# Altium schematic sheet MANEA_TCAD_PROIECT_Sheet1.SchDoc (part 3 of 3)
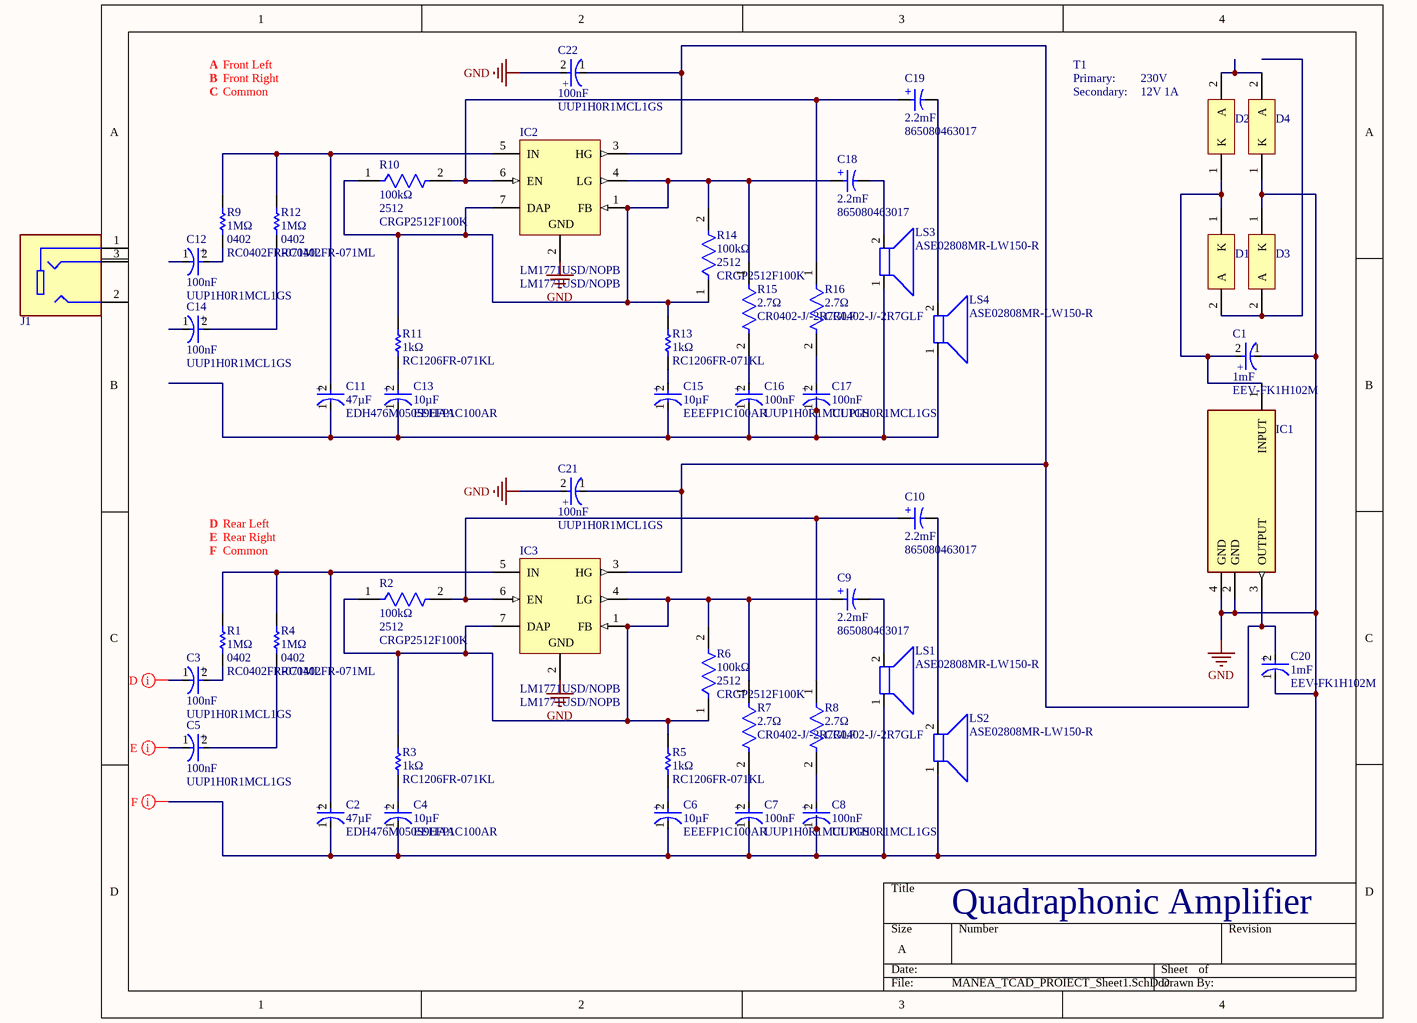
[diagram p2: MANEA_TCAD_PROIECT_Sheet1.SchDoc]

## Library data of the parts (continued)
R3 R5 R11 R13 = RC1206FR-071KL: 250mW Thick Film Resistors 200V ±100ppm/℃ ±1% 1kΩ 1206 Chip Resistor - Surface Mount ROHS; Manufacturer: Yageo Group; Temperature Coefficient: 100ppm/°C; Supplier: Farnell; Supplier Part Number: RC1206FR-071KL; Manufacturer Part Number: RC1206FR-071KL; RoHS: Compliant; Category: Chip SMD Resistors; Stock: 132012; Pricing: 500=500, 1000=0.05, 2500=0.05 (EUR); Case/Package: 1206; Case Code (Imperial): 1206; Case Code (Metric): 3216; China RoHS: Non-Compliant; Composition: Thick Film; Country of Origin: Mainland China, Taiwan; Depth: 1.6mm; Export Control Classification Number (ECCN) Code: EAR99; Height: 550µm; Harmonized Tariff Schedule (HTS) Code: 8533.21.00.30; Introduction Date: 2008-07-18; Lead Free: Lead Free; Length: 3.1mm; Lifecycle Status: Production; Max Operating Temperature: 155°C; Military Standard: Not; Min Operating Temperature: -55°C; Mounting Technology: Surface Mount; Pins: 2; Number of Terminals: 2; Packaging: Tape & Reel; Power Dissipation: 250mW; Power Rating: 250mW; REACH SVHC: Yes; Schedule B: 8533210045, 8533210045|8533210045, 8533210045|8533210045|8533210045, 8533210045|8533210045|8533210045|8533210045; Termination: SMD/SMT; Tolerance: 1%; Voltage Rating: 200V; Voltage Rating (AC): 200V; Voltage Rating (DC): 200V; Width: 1.6mm; Working Voltage: 200V; ComponentLink1URL: https://datasheet.octopart.com:443/RC1206FR-071KL-Yageo-datasheet-175887523.pdf?src-supplier=Newark; ComponentLink1Description: https://datasheet.octopart.com:443/RC1206FR-071KL-Yageo-datasheet-175887523.pdf?src-supplier=Newark; ComponentLink2URL: https://datasheet.octopart.com:443/RC1206FR-071KL-Yageo-datasheet-103092701.pdf?src-supplier=Upverter; ComponentLink2Description: https://datasheet.octopart.com:443/RC1206FR-071KL-Yageo-datasheet-103092701.pdf?src-supplier=Upverter; ComponentLink3URL: https://datasheet.octopart.com:443/RC1206FR-071KL-Yageo-datasheet-98239111.pdf?src-supplier=Upverter; ComponentLink3Description: https://datasheet.octopart.com:443/RC1206FR-071KL-Yageo-datasheet-98239111.pdf?src-supplier=Upverter; ComponentLink4URL: https://datasheet.octopart.com:443/RC1206FR-071KL-Yageo-datasheet-8359522.pdf?src-supplier=element14+APAC; ComponentLink4Description: https://datasheet.octopart.com:443/RC1206FR-071KL-Yageo-datasheet-8359522.pdf?src-supplier=element14+APAC; ComponentLink5URL: https://datasheet.octopart.com:443/RC1206FR-071KL-Yageo-datasheet-13032847.pdf?src-supplier=element14+APAC; ComponentLink5Description: https://datasheet.octopart.com:443/RC1206FR-071KL-Yageo-datasheet-13032847.pdf?src-supplier=element14+APAC; ComponentLink6URL: https://datasheet.octopart.com:443/RC1206FR-071KL-Yageo-datasheet-62067350.pdf?src-supplier=Farnell; ComponentLink6Description: https://datasheet.octopart.com:443/RC1206FR-071KL-Yageo-datasheet-62067350.pdf?src-supplier=Farnell; ComponentLink7URL: https://datasheet.octopart.com:443/RC1206FR-071KL-Yageo-Group-datasheet-176638170.pdf?src-supplier=Future+Electronics; ComponentLink7Description: https://datasheet.octopart.com:443/RC1206FR-071KL-Yageo-Group-datasheet-176638170.pdf?src-supplier=Future+Electronics; ComponentLink8URL: https://datasheet.octopart.com:443/RC1206FR-071KL-Yageo-datasheet-164759695.pdf?src-supplier=Future+Electronics; ComponentLink8Description: https://datasheet.octopart.com:443/RC1206FR-071KL-Yageo-datasheet-164759695.pdf?src-supplier=Future+Electronics; ComponentLink9URL: https://datasheet.octopart.com:443/RC1206FR-071KL-Yageo-datasheet-137700087.pdf?src-supplier=Future+Electronics; ComponentLink9Description: https://datasheet.octopart.com:443/RC1206FR-071KL-Yageo-datasheet-137700087.pdf?src-supplier=Future+Electronics; ComponentLink10URL: https://datasheet.octopart.com:443/RC1206FR-071KL-Yageo-datasheet-27233761.pdf?src-supplier=Future+Electronics; ComponentLink10Description: https://datasheet.octopart.com:443/RC1206FR-071KL-Yageo-datasheet-27233761.pdf?src-supplier=Future+Electronics; ComponentLink11URL: https://datasheet.octopart.com:443/RC1206FR-071KL-Yageo-datasheet-8324387.pdf?src-supplier=Future+Electronics; ComponentLink11Description: https://datasheet.octopart.com:443/RC1206FR-071KL-Yageo-datasheet-8324387.pdf?src-supplier=Future+Electronics; ComponentLink12URL: https://datasheet.octopart.com:443/RC1206FR-071KL-Yageo-datasheet-79472498.pdf?src-supplier=Megastar; ComponentLink12Description: https://datasheet.octopart.com:443/RC1206FR-071KL-Yageo-datasheet-79472498.pdf?src-supplier=Megastar; ComponentLink13URL: https://datasheet.octopart.com/RC1206FR-071KL-Yageo-datasheet-73766026.pdf; ComponentLink13Description: https://datasheet.octopart.com/RC1206FR-071KL-Yageo-datasheet-73766026.pdf; ComponentLink14URL: https://datasheet.octopart.com:443/RC1206FR-071KL-Yageo-datasheet-118639.pdf?src-supplier=DigiKey; ComponentLink14Description: https://datasheet.octopart.com:443/RC1206FR-071KL-Yageo-datasheet-118639.pdf?src-supplier=DigiKey; ComponentLink15URL: http://sigma.octopart.com:80/conflict_mineral_statement/Yageo-company-3.pdf?src-supplier=Compliance+Statements; ComponentLink15Description: http://sigma.octopart.com:80/conflict_mineral_statement/Yageo-company-3.pdf?src-supplier=Compliance+Statements; ComponentLink16URL: http://sigma.octopart.com:80/rohs_statement/Yageo-company-2.pdf?src-supplier=Compliance+Statements; ComponentLink16Description: http://sigma.octopart.com:80/rohs_statement/Yageo-company-2.pdf?src-supplier=Compliance+Statements
R7 R8 R15 R16 = CR0402-J/-2R7GLF: CR0402 FIXED RESISTOR 0402 (1005Metric) Chip Resistor ±5% -250/ +500ppm/C 2.7Ohm 0.063W 1/16W; Manufacturer: Bourns; Max Power Dissipation: 63mW; Power Rating: 62.5mW; Temperature Coefficient: 500ppm/°C; Voltage Rating: 50V; Supplier: DigiKey; Supplier Part Number: CR0402-J/-2R7GLFDKR-ND; Manufacturer Part Number: CR0402-J/-2R7GLF; RoHS: Compliant; Category: Chip SMD Resistors; Pricing: 1=0.1, 10=0.02, 25=0.0144, 50=0.0114, 100=0.0091, 250=0.00696, 500=0.00574, 1000=0.0048, 5000=0.00333 (USD); Case/Package: 0402; Case Code (Imperial): 0402; Case Code (Metric): 1005; China RoHS: Non-Compliant; Composition: Thick Film; Contact Plating: Tin; Country of Origin: Taiwan; Depth: 500µm; Export Control Classification Number (ECCN) Code: EAR99; Height: 320µm; Harmonized Tariff Schedule (HTS) Code: 8533.21.00.30; Introduction Date: 2003-04-07; Length: 1mm; Lifecycle Status: Production; Max Operating Temperature: 155°C; Military Standard: Not; Min Operating Temperature: -55°C; Mounting Technology: Surface Mount; Number of Terminals: 2; Power Dissipation: 63mW; Radiation Hardening: No; REACH SVHC: Yes; Termination: SMD/SMT; Tolerance: 5%; Width: 500µm; Working Voltage: 50V; ComponentLink1URL: https://datasheet.octopart.com:443/CR0402-J--2R7GLF-Bourns-datasheet-159578630.pdf?src-supplier=IHS; ComponentLink1Description: https://datasheet.octopart.com:443/CR0402-J--2R7GLF-Bourns-datasheet-159578630.pdf?src-supplier=IHS; ComponentLink2URL: https://datasheet.octopart.com:443/CR0402-J--2R7GLF-Bourns-datasheet-181955239.pdf?src-supplier=IHS; ComponentLink2Description: https://datasheet.octopart.com:443/CR0402-J--2R7GLF-Bourns-datasheet-181955239.pdf?src-supplier=IHS; ComponentLink3URL: https://datasheet.octopart.com:443/CR0402-J--2R7GLF-Bourns-datasheet-68301632.pdf?src-supplier=Electro+Sonic; ComponentLink3Description: https://datasheet.octopart.com:443/CR0402-J--2R7GLF-Bourns-datasheet-68301632.pdf?src-supplier=Electro+Sonic; ComponentLink4URL: https://datasheet.octopart.com/CR0402-J/-2R7GLF-Bourns-datasheet-8723995.pdf; ComponentLink4Description: https://datasheet.octopart.com/CR0402-J/-2R7GLF-Bourns-datasheet-8723995.pdf; ComponentLink5URL: http://sigma.octopart.com:80/conflict_mineral_statement/Bourns-company-36.pdf?src-supplier=Compliance+Statements; ComponentLink5Description: http://sigma.octopart.com:80/conflict_mineral_statement/Bourns-company-36.pdf?src-supplier=Compliance+Statements